# EAGLE schematic STM32EDUv1p0 (EAGLE 5.10)

## Sheet 1 of 3
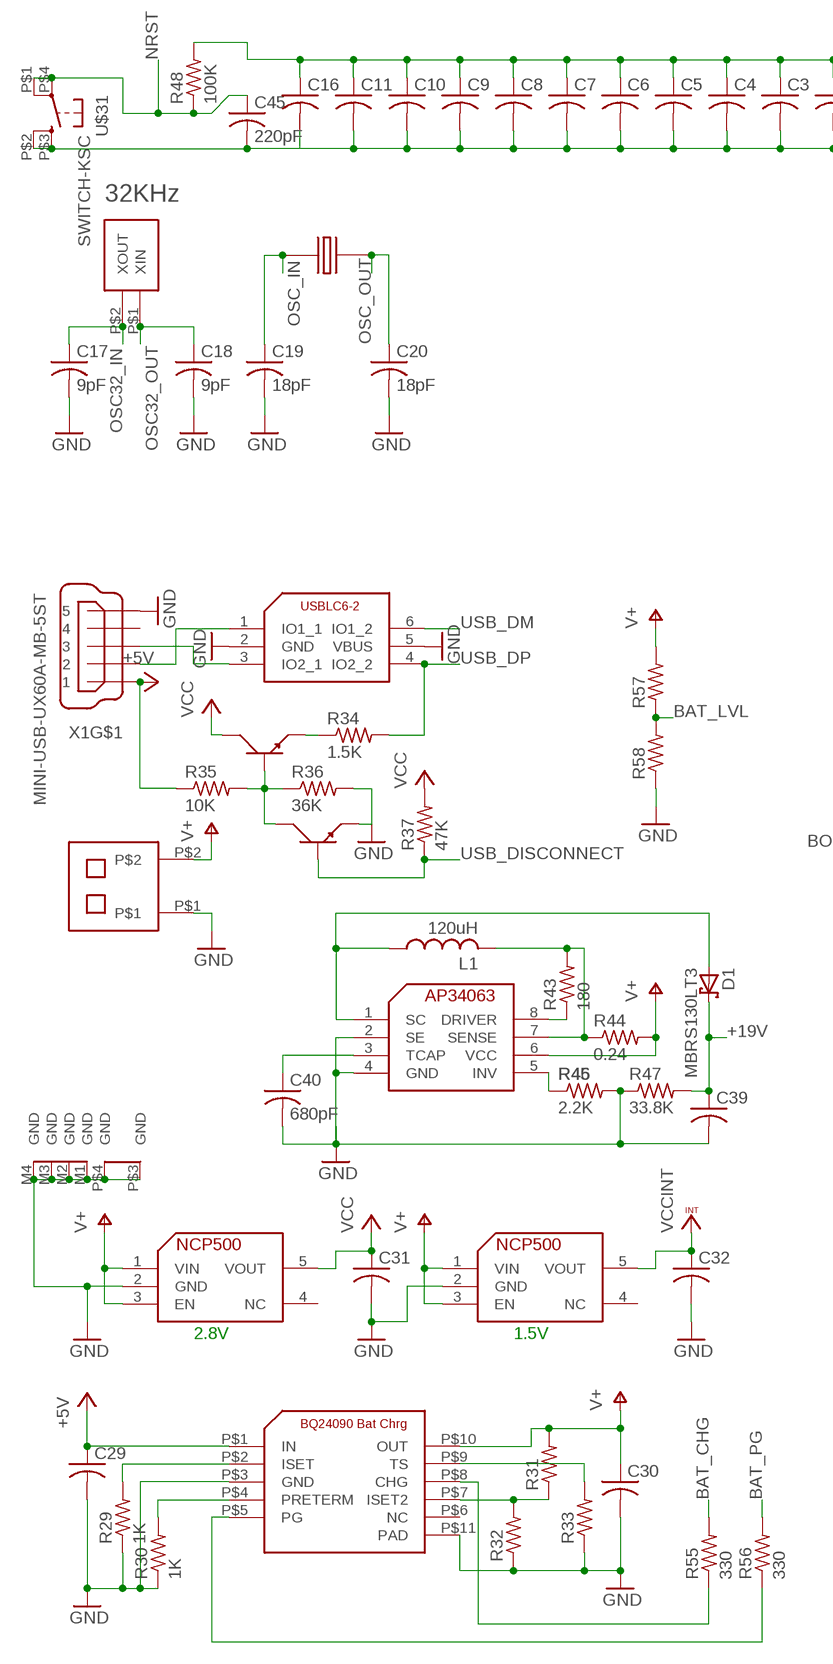
[diagram p0: schematic, sheet 1, part 1 of 2]
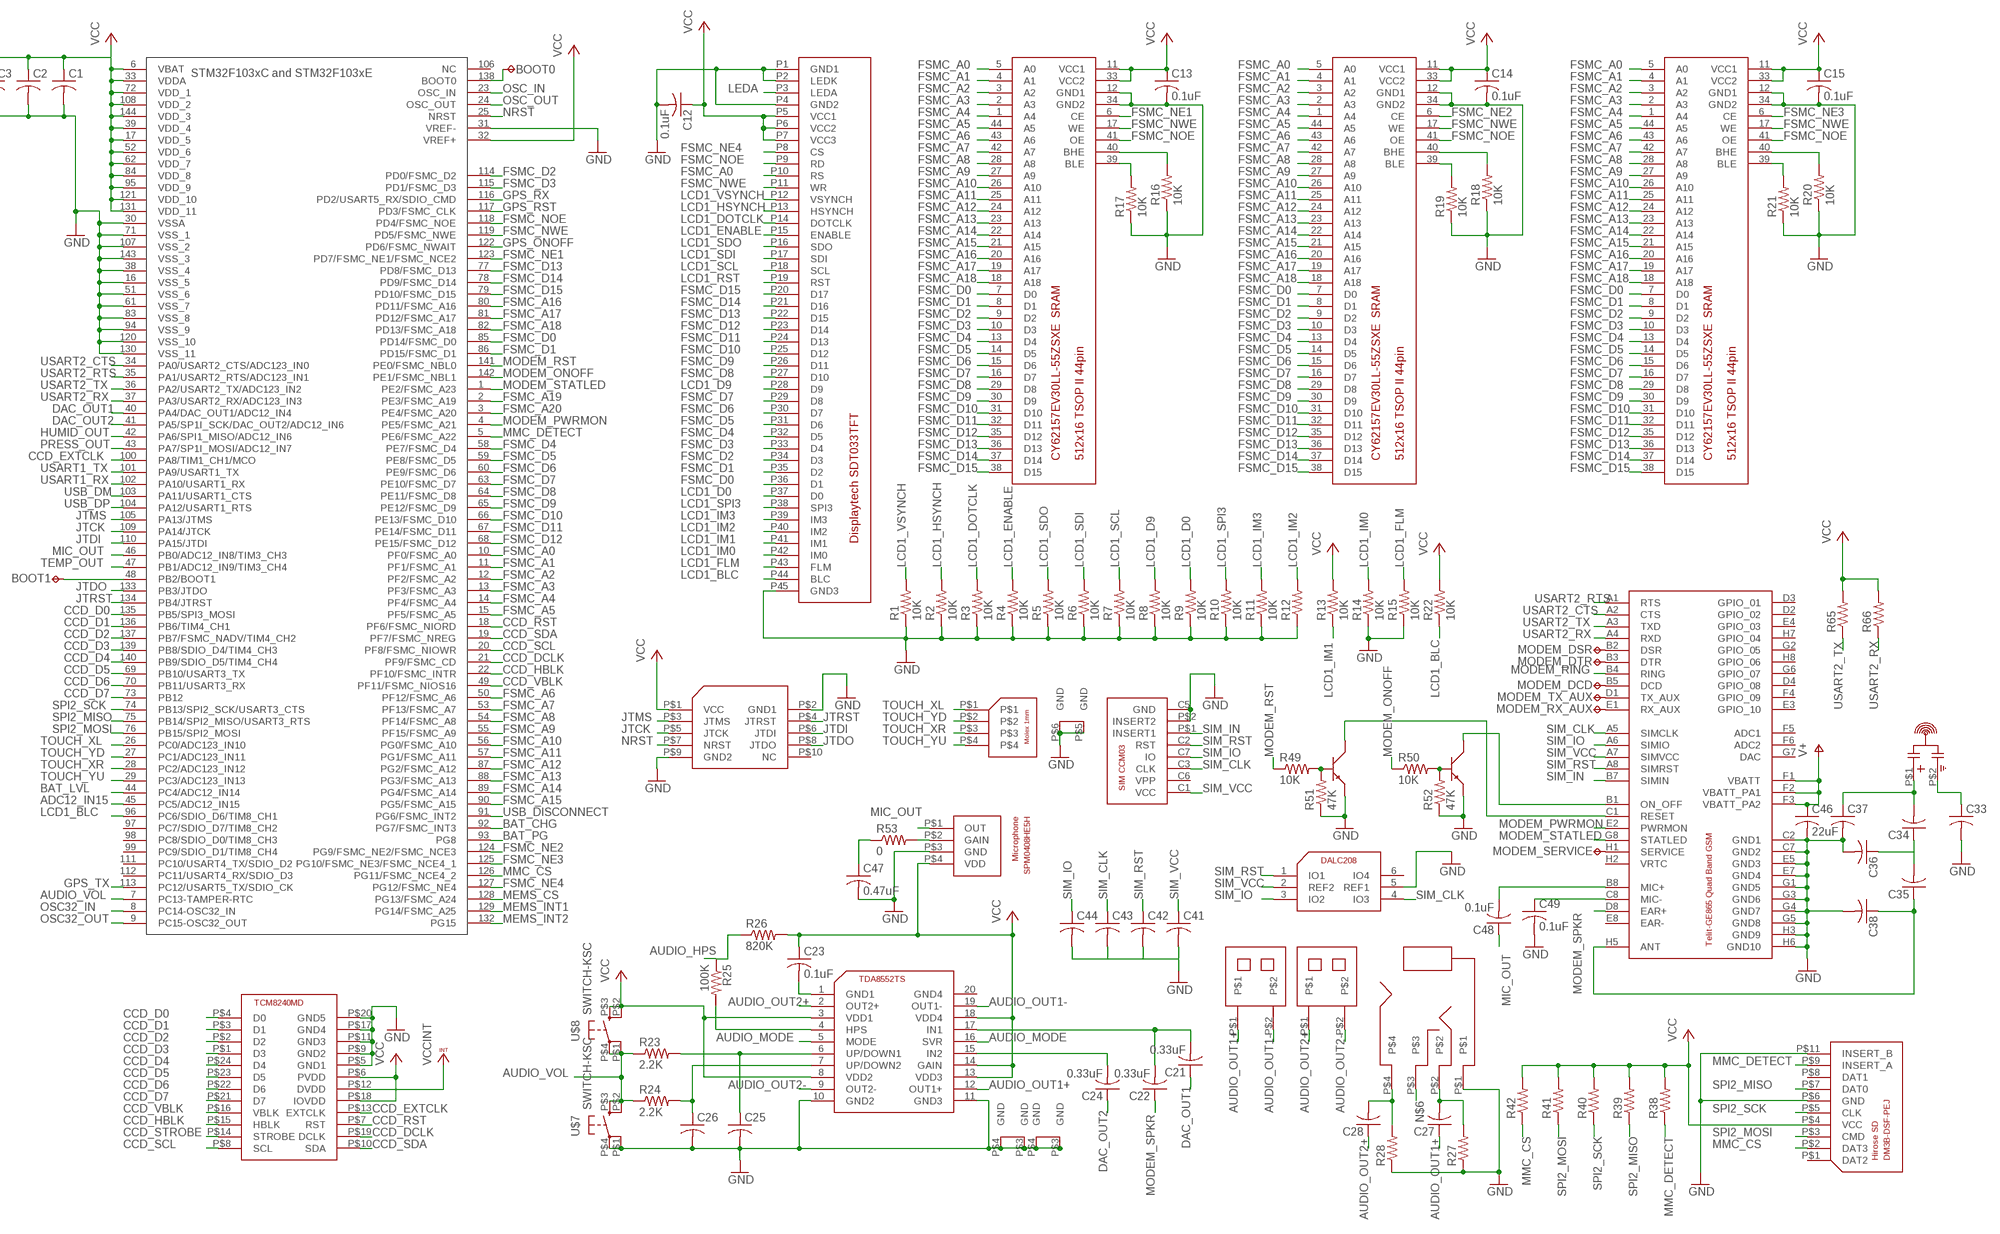
[diagram p1: schematic, sheet 1, part 2 of 2]

### Parts
BOOT0  TPB1,27  [B1,27]
BOOT1  TPB1,27  [B1,27]
C1  C-USC0402  [C0402]
C2  C-USC0402  [C0402]
C3  C-USC0402  [C0402]
C4  C-USC0402  [C0402]
C5  C-USC0402  [C0402]
C6  C-USC0402  [C0402]
C7  C-USC0402  [C0402]
C8  C-USC0402  [C0402]
C9  C-USC0402  [C0402]
C10  C-USC0402  [C0402]
C11  C-USC0402  [C0402]
C12  0.1uF  C-USC0402  [C0402]
C13  0.1uF  C-USC0402  [C0402]
C14  0.1uF  C-USC0402  [C0402]
C15  0.1uF  C-USC0402  [C0402]
C16  C-USC0402  [C0402]
C17  9pF  C-USC0402  [C0402]
C18  9pF  C-USC0402  [C0402]
C19  18pF  C-USC0402  [C0402]
C20  18pF  C-USC0402  [C0402]
C21  0.33uF  C-USC0402  [C0402]
C22  0.33uF  C-USC0402  [C0402]
C23  0.1uF  C-USC0402  [C0402]
C24  0.33uF  C-USC0402  [C0402]
C25  C-USC0402  [C0402]
C26  C-USC0402  [C0402]
C27  C-USC0402  [C0402]
C28  C-USC0402  [C0402]
C29  C-USC1206  [C1206]
C30  C-USC1206  [C1206]
C31  C-USC0402  [C0402]
C32  C-USC0402  [C0402]
C33  C-USC0603  [C0603]
C34  C-USC0603  [C0603]
C35  C-USC0603  [C0603]
C36  C-USC0603  [C0603]
C37  C-USC0603  [C0603]
C38  C-USC0603  [C0603]
C39  C-USC1206  [C1206]
C40  680pF  C-USC0402  [C0402]
C41  C-USC0402  [C0402]
C42  C-USC0402  [C0402]
C43  C-USC0402  [C0402]
C44  C-USC0402  [C0402]
C45  220pF  C-USC0402  [C0402]
C46  22uF  C-USC1206  [C1206]
C47  0.47uF  C-USC0402  [C0402]
C48  0.1uF  C-USC0402  [C0402]
C49  0.1uF  C-USC0402  [C0402]
D1  MBRS130LT3  [SMB]
L1  120uH  L-USL5038P  [L5038P]
MODEM_DCD  TPB1,27  [B1,27]
MODEM_DSR  TPB1,27  [B1,27]
MODEM_DTR  TPB1,27  [B1,27]
MODEM_RX_AUX  TPB1,27  [B1,27]
MODEM_SERVICE  TPB1,27  [B1,27]
MODEM_TX_AUX  TPB1,27  [B1,27]
R1  10K  R-US_R0402  [R0402]
R2  10K  R-US_R0402  [R0402]
R3  10K  R-US_R0402  [R0402]
R4  10K  R-US_R0402  [R0402]
R5  10K  R-US_R0402  [R0402]
R6  10K  R-US_R0402  [R0402]
R7  10K  R-US_R0402  [R0402]
R8  10K  R-US_R0402  [R0402]
R9  10K  R-US_R0402  [R0402]
R10  10K  R-US_R0402  [R0402]
R11  10K  R-US_R0402  [R0402]
R12  R-US_R0402  [R0402]
R13  10K  R-US_R0402  [R0402]
R14  10K  R-US_R0402  [R0402]
R15  10K  R-US_R0402  [R0402]
R16  10K  R-US_R0402  [R0402]
R17  10K  R-US_R0402  [R0402]
R18  10K  R-US_R0402  [R0402]
R19  10K  R-US_R0402  [R0402]
R20  10K  R-US_R0402  [R0402]
R21  10K  R-US_R0402  [R0402]
R22  10K  R-US_R0402  [R0402]
R23  2.2K  R-US_R0402  [R0402]
R24  2.2K  R-US_R0402  [R0402]
R25  100K  R-US_R0402  [R0402]
R26  820K  R-US_R0402  [R0402]
R27  R-US_R0402  [R0402]
R28  R-US_R0402  [R0402]
R29  1K  R-US_R0402  [R0402]
R30  1K  R-US_R0402  [R0402]
R31  R-US_R0402  [R0402]
R32  R-US_R0402  [R0402]
R33  R-US_R0402  [R0402]
R34  1.5K  R-US_R0402  [R0402]
R35  10K  R-US_R0402  [R0402]
R36  36K  R-US_R0402  [R0402]
R37  47K  R-US_R0402  [R0402]
R38  R-US_R0402  [R0402]
R39  R-US_R0402  [R0402]
R40  R-US_R0402  [R0402]
R41  R-US_R0402  [R0402]
R42  R-US_R0402  [R0402]
R43  180  R-US_R0402  [R0402]
R44  0.24  R-US_R0603  [R0603]
R45  R-US_R0402  [R0402]
R46  2.2K  R-US_R0402  [R0402]
R47  33.8K  R-US_R0402  [R0402]
R48  100K  R-US_R0402  [R0402]
R49  10K  R-US_R0402  [R0402]
R50  10K  R-US_R0402  [R0402]
R51  47K  R-US_R0402  [R0402]
R52  47K  R-US_R0402  [R0402]
R53  0  R-US_R0402  [R0402]
R55  330  R-US_R0402  [R0402]
R56  330  R-US_R0402  [R0402]
R57  R-US_R0402  [R0402]
R58  R-US_R0402  [R0402]
R65  R-US_R0402  [R0402]
R66  R-US_R0402  [R0402]
U3  CM415  [CM415]
U5  CRYSTAL-ABM3  [ABM3]
U$1  TCM8240MD  [TCM8240MD]
U$2  STM32F103XE  [PQFP144]
U$3  MOLEX-1.0-FPC-RA-CONN-4POS  [MOLEX-1.0-FPC-RA-CONN-4POS]
U$4  NCP500  [SOT23-5L]
U$5  TDA8552TS  [SSOP20]
U$6  BQ24090  [R-PDSO-G10]
U$7  SWITCH-KSC  [SWITCH_KMS]
U$8  SWITCH-KSC  [SWITCH_KMS]
U$9  MOLEX-1.25-WTB-RA-CONN-2POS  [MOLEX-1.25WTB-RA-CONN]
U$10  STM32-JTAG-10P  [STM32-JTAG-10P]
U$11  DISPLAYTECH-SDT033TFTH  [HIROSE-FFC-FH19SC-45]
U$12  CY62157EV30LL-55ZSXE  [TSOPII-44]
U$13  CY62157EV30LL-55ZSXE  [TSOPII-44]
U$14  CY62157EV30LL-55ZSXE  [TSOPII-44]
U$15  MOLEX-1.25-WTB-RA-CONN-2POS  [MOLEX-1.25WTB-RA-CONN]
U$16  MOLEX-1.25-WTB-RA-CONN-2POS  [MOLEX-1.25WTB-RA-CONN]
U$17  KOBICONN-161-4034-E-TOP  [KOBICONN-161-403X-E-TOP]
U$18  NCP500  [SOT23-5L]
U$19  TELIT-GE865T  [TELIT-GE865]
U$20  CCM03-3009  [CCM03-300X]
U$21  DIODESINC-AP34063  [SO08]
U$22  USBLC6-2  [SOT23-6L]
U$23  PMBT6428  [SOT23]
U$24  PMBT6428  [SOT23]
U$25  HIROSE-SDCARD-DM3B-DSF-PEJ  [HIROSE-SDCARD-DM3B-DSF-PEJ]
U$26  REFLEXUS-A10315  [REFLEXUS-A10315]
U$27  DALC208  [SOT23-6L]
U$28  SPM0408HE5H  [SP0408HE5H-BOT]
U$29  PMBT6428  [SOT23]
U$30  PMBT6428  [SOT23]
U$31  SWITCH-KSC  [SWITCH_KMS]
X1  MINI-USB-UX60A-MB-5ST  [UX60A-MB-5ST]

### Nets
+5V: C29.1 R35.1 U$6.P$1(IN) X1.1
+19V: C39.1 D1.C R47.2
ADC12_IN15: U$2.45(PC5/ADC12_IN15)
AUDIO_HPS: R25.1 R26.1
AUDIO_MODE: U$5.5(MODE) U$5.16(SVR)
AUDIO_OUT1+: C27.1 U$5.12(OUT1+) U$9.P$1
AUDIO_OUT1-: U$5.19(OUT1-) U$9.P$2
AUDIO_OUT2+: C28.1 U$5.2(OUT2+) U$15.P$1
AUDIO_OUT2-: U$5.9(OUT2-) U$15.P$2
AUDIO_VOL: R23.1 R24.1 U$2.7(PC13-TAMPER-RTC) U$7.P$2(P3) U$7.P$3(P1) U$8.P$1(P4) U$8.P$4(P2)
BAT_CHG: R55.2 U$2.92(PG7/FSMC_INT3)
BAT_LVL: R57.1 R58.2 U$2.44(PC4/ADC12_IN14)
BAT_PG: R56.2 U$2.93(PG8)
CCD_D0: U$1.P$4(D0) U$2.135(PB5/SPI3_MOSI)
CCD_D1: U$1.P$3(D1) U$2.136(PB6/TIM4_CH1)
CCD_D2: U$1.P$2(D2) U$2.137(PB7/FSMC_NADV/TIM4_CH2)
CCD_D3: U$1.P$1(D3) U$2.139(PB8/SDIO_D4/TIM4_CH3)
CCD_D4: U$1.P$24(D4) U$2.140(PB9/SDIO_D5/TIM4_CH4)
CCD_D5: U$1.P$23(D5) U$2.69(PB10/USART3_TX)
CCD_D6: U$1.P$22(D6) U$2.70(PB11/USART3_RX)
CCD_D7: U$1.P$21(D7) U$2.73(PB12)
CCD_DCLK: U$1.P$19(DCLK) U$2.21(PF9/FSMC_CD)
CCD_EXTCLK: U$1.P$13(EXTCLK) U$2.100(PA8/TIM1_CH1/MCO)
CCD_HBLK: U$1.P$15(HBLK) U$2.22(PF10/FSMC_INTR)
CCD_RST: U$1.P$7(RST) U$2.18(PF6/FSMC_NIORD)
CCD_SCL: U$1.P$8(SCL) U$2.20(PF8/FSMC_NIOWR)
CCD_SDA: U$1.P$10(SDA) U$2.19(PF7/FSMC_NREG)
CCD_STROBE: U$1.P$14(STROBE)
CCD_VBLK: U$1.P$16(VBLK) U$2.49(PF11/FSMC_NIOS16)
DAC_OUT1: C21.1 U$2.40(PA4/DAC_OUT1/ADC12_IN4)
DAC_OUT2: C24.1 U$2.41(PA5/SP1I_SCK/DAC_OUT2/ADC12_IN6)
FSMC_A0: U$2.10(PF0/FSMC_A0) U$11.P10(RS) U$12.5(A0) U$13.5(A0) U$14.5(A0)
FSMC_A1: U$2.11(PF1/FSMC_A1) U$12.4(A1) U$13.4(A1) U$14.4(A1)
FSMC_A2: U$2.12(PF2/FSMC_A2) U$12.3(A2) U$13.3(A2) U$14.3(A2)
FSMC_A3: U$2.13(PF3/FSMC_A3) U$12.2(A3) U$13.2(A3) U$14.2(A3)
FSMC_A4: U$2.14(PF4/FSMC_A4) U$12.1(A4) U$13.1(A4) U$14.1(A4)
FSMC_A5: U$2.15(PF5/FSMC_A5) U$12.44(A5) U$13.44(A5) U$14.44(A5)
FSMC_A6: U$2.50(PF12/FSMC_A6) U$12.43(A6) U$13.43(A6) U$14.43(A6)
FSMC_A7: U$2.53(PF13/FSMC_A7) U$12.42(A7) U$13.42(A7) U$14.42(A7)
FSMC_A8: U$2.54(PF14/FSMC_A8) U$12.28(A8) U$13.28(A8) U$14.28(A8)
FSMC_A9: U$2.55(PF15/FSMC_A9) U$12.27(A9) U$13.27(A9) U$14.27(A9)
FSMC_A10: U$2.56(PG0/FSMC_A10) U$12.26(A10) U$13.26(A10) U$14.26(A10)
FSMC_A11: U$2.57(PG1/FSMC_A11) U$12.25(A11) U$13.25(A11) U$14.25(A11)
FSMC_A12: U$2.87(PG2/FSMC_A12) U$12.24(A12) U$13.24(A12) U$14.24(A12)
FSMC_A13: U$2.88(PG3/FSMC_A13) U$12.23(A13) U$13.23(A13) U$14.23(A13)
FSMC_A14: U$2.89(PG4/FSMC_A14) U$12.22(A14) U$13.22(A14) U$14.22(A14)
FSMC_A15: U$2.90(PG5/FSMC_A15) U$12.21(A15) U$13.21(A15) U$14.21(A15)
FSMC_A16: U$2.80(PD11/FSMC_A16) U$12.20(A16) U$13.20(A16) U$14.20(A16)
FSMC_A17: U$2.81(PD12/FSMC_A17) U$12.19(A17) U$13.19(A17) U$14.19(A17)
FSMC_A18: U$2.82(PD13/FSMC_A18) U$12.18(A18) U$13.18(A18) U$14.18(A18)
FSMC_A19: U$2.2(PE3/FSMC_A19)
FSMC_A20: U$2.3(PE4/FSMC_A20)
FSMC_D0: U$2.85(PD14/FSMC_D0) U$11.P36(D1) U$12.7(D0) U$13.7(D0) U$14.7(D0)
FSMC_D1: U$2.86(PD15/FSMC_D1) U$11.P35(D2) U$12.8(D1) U$13.8(D1) U$14.8(D1)
FSMC_D2: U$2.114(PD0/FSMC_D2) U$11.P34(D3) U$12.9(D2) U$13.9(D2) U$14.9(D2)
FSMC_D3: U$2.115(PD1/FSMC_D3) U$11.P33(D4) U$12.10(D3) U$13.10(D3) U$14.10(D3)
FSMC_D4: U$2.58(PE7/FSMC_D4) U$11.P32(D5) U$12.13(D4) U$13.13(D4) U$14.13(D4)
FSMC_D5: U$2.59(PE8/FSMC_D5) U$11.P31(D6) U$12.14(D5) U$13.14(D5) U$14.14(D5)
FSMC_D6: U$2.60(PE9/FSMC_D6) U$11.P30(D7) U$12.15(D6) U$13.15(D6) U$14.15(D6)
FSMC_D7: U$2.63(PE10/FSMC_D7) U$11.P29(D8) U$12.16(D7) U$13.16(D7) U$14.16(D7)
FSMC_D8: U$2.64(PE11/FSMC_D8) U$11.P27(D10) U$12.29(D8) U$13.29(D8) U$14.29(D8)
FSMC_D9: U$2.65(PE12/FSMC_D9) U$11.P26(D11) U$12.30(D9) U$13.30(D9) U$14.30(D9)
FSMC_D10: U$2.66(PE13/FSMC_D10) U$11.P25(D12) U$12.31(D10) U$13.31(D10) U$14.31(D10)
FSMC_D11: U$2.67(PE14/FSMC_D11) U$11.P24(D13) U$12.32(D11) U$13.32(D11) U$14.32(D11)
FSMC_D12: U$2.68(PE15/FSMC_D12) U$11.P23(D14) U$12.35(D12) U$13.35(D12) U$14.35(D12)
FSMC_D13: U$2.77(PD8/FSMC_D13) U$11.P22(D15) U$12.36(D13) U$13.36(D13) U$14.36(D13)
FSMC_D14: U$2.78(PD9/FSMC_D14) U$11.P21(D16) U$12.37(D14) U$13.37(D14) U$14.37(D14)
FSMC_D15: U$2.79(PD10/FSMC_D15) U$11.P20(D17) U$12.38(D15) U$13.38(D15) U$14.38(D15)
FSMC_NE1: U$2.123(PD7/FSMC_NE1/FSMC_NCE2) U$12.6(CE)
FSMC_NE2: U$2.124(PG9/FSMC_NE2/FSMC_NCE3) U$13.6(CE)
FSMC_NE3: U$2.125(PG10/FSMC_NE3/FSMC_NCE4_1) U$14.6(CE)
FSMC_NE4: U$2.127(PG12/FSMC_NE4) U$11.P8(CS)
FSMC_NOE: U$2.118(PD4/FSMC_NOE) U$11.P9(RD) U$12.41(OE) U$13.41(OE) U$14.41(OE)
FSMC_NWE: U$2.119(PD5/FSMC_NWE) U$11.P11(WR) U$12.17(WE) U$13.17(WE) U$14.17(WE)
GND: C1.2 C2.2 C3.2 C4.2 C5.2 C6.2 C7.2 C8.2 C9.2 C10.2 C11.2 C12.2 C13.2 C14.2 C15.2 C16.2 C17.2 C18.2 C19.2 C20.2 C25.2 C26.2 C29.2 C30.2 C31.2 C32.2 C33.2 C36.2 C37.2 C38.2 C39.2 C40.2 C41.2 C42.2 C43.2 C44.2 C45.2 C46.2 C47.2 C49.2 R1.1 R2.1 R3.1 R4.1 R5.1 R6.1 R7.1 R8.1 R9.1 R10.1 R11.1 R12.1 R14.1 R15.1 R16.1 R17.1 R18.1 R19.1 R20.1 R21.1 R27.1 R28.1 R29.1 R30.1 R32.1 R33.1 R36.2 R45.2 R46.2 R47.1 R51.1 R52.1 R58.1 U$1.P$5(GND1) U$1.P$9(GND2) U$1.P$11(GND3) U$1.P$17(GND4) U$1.P$20(GND5) U$2.16(VSS_5) U$2.30(VSSA) U$2.31(VREF-) U$2.38(VSS_4) U$2.51(VSS_6) U$2.61(VSS_7) U$2.71(VSS_1) U$2.83(VSS_8) U$2.94(VSS_9) U$2.107(VSS_2) U$2.120(VSS_10) U$2.130(VSS_11) U$2.143(VSS_3) U$3.P$5(GND) U$3.P$6(GND) U$4.2(GND) U$5.10(GND2) U$5.11(GND3) U$6.P$3(GND) U$6.P$11(PAD) U$7.P$1(P4) U$7.P$4(P2) U$9.P$3(GND) U$9.P$4(GND) U$10.P$2(GND1) U$10.P$9(GND2) U$11.P1(GND1) U$11.P2(LEDK) U$11.P4(GND2) U$11.P45(GND3) U$12.12(GND1) U$12.34(GND2) U$13.12(GND1) U$13.34(GND2) U$14.12(GND1) U$14.34(GND2) U$15.P$3(GND) U$15.P$4(GND) U$16.P$1 U$16.P$3(GND) U$16.P$4(GND) U$17.P$1 U$18.2(GND) U$19.C2(GND1) U$19.C7(GND2) U$19.E5(GND3) U$19.E7(GND4) U$19.G1(GND5) U$19.G3(GND6) U$19.G4(GND7) U$19.G5(GND8) U$19.H3(GND9) U$19.H6(GND10) U$20.C5(GND) U$20.P$2(INSERT2) U$21.2(SE) U$21.4(GND) U$22.2(GND) U$22.5(VBUS) U$24.2 U$25.P$6(GND) U$25.P$11(INSERT_B) U$27.5(REF1) U$28.P$3(GND) U$29.2 U$30.2 U$31.P$2(P3) U$31.P$3(P1) X1.5 X1.M1(GND) X1.M2(GND) X1.M3(GND) X1.M4(GND) ; also sheet 2,3
GPS_ONOFF: U$2.122(PD6/FSMC_NWAIT) ; also sheet 3
GPS_RST: U$2.117(PD3/FSMC_CLK) ; also sheet 3
GPS_RX: U$2.116(PD2/USART5_RX/SDIO_CMD) ; also sheet 3
GPS_TX: U$2.113(PC12/USART5_TX/SDIO_CK) ; also sheet 3
HUMID_OUT: U$2.42(PA6/SPI1_MISO/ADC12_IN6) ; also sheet 2
JTCK: U$2.109(PA14/JTCK) U$10.P$5(JTCK)
JTDI: U$2.110(PA15/JTDI) U$10.P$6(JTDI)
JTDO: U$2.133(PB3/JTDO) U$10.P$8(JTDO)
JTMS: U$2.105(PA13/JTMS) U$10.P$3(JTMS)
JTRST: U$2.134(PB4/JTRST) U$10.P$4(JTRST)
LCD1_BLC: R22.1 U$2.96(PC6/SDIO_D6/TIM8_CH1) U$11.P44(BLC)
LCD1_D0: R9.2 U$11.P37(D0)
LCD1_D9: R8.2 U$11.P28(D9)
LCD1_DOTCLK: R3.2 U$11.P14(DOTCLK)
LCD1_ENABLE: R4.2 U$11.P15(ENABLE)
LCD1_FLM: R15.2 U$11.P43(FLM)
LCD1_HSYNCH: R2.2 U$11.P13(HSYNCH)
LCD1_IM0: R14.2 U$11.P42(IM0)
LCD1_IM1: R13.1 U$11.P41(IM1)
LCD1_IM2: R12.2 U$11.P40(IM2)
LCD1_IM3: R11.2 U$11.P39(IM3)
LCD1_RST: U$11.P19(RST)
LCD1_SCL: R7.2 U$11.P18(SCL)
LCD1_SDI: R6.2 U$11.P17(SDI)
LCD1_SDO: R5.2 U$11.P16(SDO)
LCD1_SPI3: R10.2 U$11.P38(SPI3)
LCD1_VSYNCH: R1.2 U$11.P12(VSYNCH)
LEDA: U$11.P3(LEDA)
MEMS_CS: U$2.128(PG13/FSMC_A24) ; also sheet 2
MEMS_INT1: U$2.129(PG14/FSMC_A25) ; also sheet 2
MEMS_INT2: U$2.132(PG15) ; also sheet 2
MIC_OUT: C48.1 U$2.46(PB0/ADC12_IN8/TIM3_CH3) U$28.P$1(OUT)
MMC_CS: R42.1 U$2.126(PG11/FSMC_NCE4_2) U$25.P$2(DAT3)
MMC_DETECT: R38.1 U$2.5(PE6/FSMC_A22) U$25.P$9(INSERT_A)
MODEM_ONOFF: R50.1 U$2.142(PE1/FSMC_NBL1)
MODEM_PWRMON: U$2.4(PE5/FSMC_A21) U$19.E2(PWRMON)
MODEM_RING: U$19.B4(RING)
MODEM_RST: R49.1 U$2.141(PE0/FSMC_NBL0)
MODEM_SPKR: C22.1 U$19.D8(EAR+)
MODEM_STATLED: U$2.1(PE2/FSMC_A23) U$19.G8(STATLED)
N$1: BOOT1.TP U$2.48(PB2/BOOT1)
N$2: BOOT0.TP U$2.138(BOOT0)
N$3: R16.2 U$12.40(BHE)
N$4: R35.2 R36.1 U$23.1 U$24.3
N$5: C23.2 U$5.1(GND1)
N$6: U$17.P$3
N$7: C28.2 R28.2 U$17.P$4
N$8: C27.2 R27.2 U$17.P$2
N$9: C21.2 C22.2 U$5.17(IN1)
N$10: C24.2 U$5.15(IN2)
N$11: C25.1 R23.2 U$5.6(UP/DOWN1)
N$12: C26.1 R24.2 U$5.7(UP/DOWN2)
N$13: R25.2 U$5.4(HPS)
N$14: R30.2 U$6.P$4(PRETERM)
N$15: R17.2 U$12.39(BLE)
N$16: R18.2 U$13.40(BHE)
N$17: R29.2 U$6.P$2(ISET)
N$18: R19.2 U$13.39(BLE)
N$19: U$22.1(IO1_1) X1.2
N$20: R33.2 U$6.P$9(TS)
N$21: R31.1 R32.2 U$6.P$7(ISET2)
N$22: U$22.3(IO2_1) X1.3
N$23: MODEM_DSR.TP U$19.B2(DSR)
N$24: MODEM_DTR.TP U$19.B3(DTR)
N$25: R34.1 U$23.2
N$26: MODEM_DCD.TP U$19.B5(DCD)
N$27: MODEM_TX_AUX.TP U$19.D1(TX_AUX)
N$28: MODEM_RX_AUX.TP U$19.E1(RX_AUX)
N$29: C34.2 C37.1 U$26.P$1(ANTP)
N$30: C34.1 C35.2 C36.1
N$31: C35.1 C38.1 U$19.H5(ANT)
N$32: C33.1 U$26.P$2(ANTN)
N$33: R43.1 U$21.8(DRIVER)
N$34: C40.1 U$21.3(TCAP)
N$35: L1.2 R43.2 R44.1 U$21.7(SENSE)
N$36: D1.A L1.1 U$21.1(SC)
N$37: R45.1 R46.1 U$21.5(INV)
N$39: U$19.C1(RESET) U$30.3
N$40: MODEM_SERVICE.TP U$19.H1(SERVICE)
N$41: U$19.B1(ON_OFF) U$29.3
N$42: R49.2 R51.2 U$30.1
N$43: R50.2 R52.2 U$29.1
N$47: R53.2 U$28.P$2(GAIN)
N$48: C47.1 R53.1
N$49: C48.2 U$19.B8(MIC+)
N$50: C49.1 U$19.C8(MIC-)
N$51: R55.1 U$6.P$8(CHG)
N$54: R56.1 U$6.P$5(PG)
N$60: R21.2 U$14.39(BLE)
N$61: R20.2 U$14.40(BHE)
NRST: C45.1 R48.1 U$2.25(NRST) U$10.P$7(NRST) U$31.P$1(P4) U$31.P$4(P2)
OSC32_IN: C17.1 U3.P$2(XOUT) U$2.8(PC14-OSC32_IN)
OSC32_OUT: C18.1 U3.P$1(XIN) U$2.9(PC15-OSC32_OUT)
OSC_IN: C19.1 U5.P$1 U$2.23(OSC_IN)
OSC_OUT: C20.1 U5.P$2 U$2.24(OSC_OUT)
PRESS_OUT: U$2.43(PA7/SP1I_MOSI/ADC12_IN7) ; also sheet 2
SIM_CLK: C43.1 U$19.A5(SIMCLK) U$20.C3(CLK) U$27.4(IO3)
SIM_IN: U$19.B7(SIMIN) U$20.P$1(INSERT1)
SIM_IO: C44.1 U$19.A6(SIMIO) U$20.C7(IO) U$27.3(IO2)
SIM_RST: C42.1 U$19.A8(SIMRST) U$20.C2(RST) U$27.1(IO1)
SIM_VCC: C41.1 U$19.A7(SIMVCC) U$20.C1(VCC) U$27.2(REF2)
SPI2_MISO: R39.1 U$2.75(PB14/SPI2_MISO/USART3_RTS) U$25.P$7(DAT0) ; also sheet 2
SPI2_MOSI: R41.1 U$2.76(PB15/SPI2_MOSI) U$25.P$3(CMD) ; also sheet 2
SPI2_SCK: R40.1 U$2.74(PB13/SPI2_SCK/USART3_CTS) U$25.P$5(CLK) ; also sheet 2
TEMP_OUT: U$2.47(PB1/ADC12_IN9/TIM3_CH4) ; also sheet 2
TOUCH_XL: U$2.26(PC0/ADC123_IN10) U$3.P$1
TOUCH_XR: U$2.28(PC2/ADC123_IN12) U$3.P$3
TOUCH_YD: U$2.27(PC1/ADC123_IN11) U$3.P$2
TOUCH_YU: U$2.29(PC3/ADC123_IN13) U$3.P$4
USART1_RX: U$2.102(PA10/USART1_RX)
USART1_TX: U$2.101(PA9/USART1_TX)
USART2_CTS: U$2.34(PA0/USART2_CTS/ADC123_IN0) U$19.A2(CTS)
USART2_RTS: U$2.35(PA1/USART2_RTS/ADC123_IN1) U$19.A1(RTS)
USART2_RX: R66.1 U$2.37(PA3/USART2_RX/ADC123_IN3) U$19.A4(RXD)
USART2_TX: R65.1 U$2.36(PA2/USART2_TX/ADC123_IN2) U$19.A3(TXD)
USB_DISCONNECT: R37.1 U$2.91(PG6/FSMC_INT2) U$24.1
USB_DM: U$2.103(PA11/USART1_CTS) U$22.6(IO1_2)
USB_DP: R34.2 U$2.104(PA12/USART1_RTS) U$22.4(IO2_2)
V+: C30.1 C46.1 R31.2 R44.2 R57.2 U$4.1(VIN) U$4.3(EN) U$6.P$10(OUT) U$16.P$2 U$18.1(VIN) U$18.3(EN) U$19.F1(VBATT) U$19.F2(VBATT_PA1) U$19.F3(VBATT_PA2) U$21.6(VCC) ; also sheet 3
VCC: C1.1 C2.1 C3.1 C4.1 C5.1 C6.1 C7.1 C8.1 C9.1 C10.1 C11.1 C12.1 C13.1 C14.1 C15.1 C16.1 C23.1 C31.1 R13.2 R22.2 R26.2 R37.2 R38.2 R39.2 R40.2 R41.2 R42.2 R48.2 R65.2 R66.2 U$1.P$6(PVDD) U$1.P$18(IOVDD) U$2.6(VBAT) U$2.17(VDD_5) U$2.32(VREF+) U$2.33(VDDA) U$2.39(VDD_4) U$2.52(VDD_6) U$2.62(VDD_7) U$2.72(VDD_1) U$2.84(VDD_8) U$2.95(VDD_9) U$2.108(VDD_2) U$2.121(VDD_10) U$2.131(VDD_11) U$2.144(VDD_3) U$4.5(VOUT) U$5.3(VDD1) U$5.8(VDD2) U$5.13(VDD3) U$5.14(GAIN) U$5.18(VDD4) U$8.P$2(P3) U$8.P$3(P1) U$10.P$1(VCC) U$11.P5(VCC1) U$11.P6(VCC2) U$11.P7(VCC3) U$12.11(VCC1) U$12.33(VCC2) U$13.11(VCC1) U$13.33(VCC2) U$14.11(VCC1) U$14.33(VCC2) U$23.3 U$25.P$4(VCC) U$28.P$4(VDD) ; also sheet 2,3
VCCINT: C32.1 U$1.P$12(DVDD) U$18.5(VOUT)
Unconnected: U$2.97(PC7/SDIO_D7/TIM8_CH2) U$2.98(PC8/SDIO_D0/TIM8_CH3) U$2.99(PC9/SDIO_D1/TIM8_CH4) U$2.106(NC) U$2.111(PC10/USART4_TX/SDIO_D2) U$2.112(PC11/USART4_RX/SDIO_D3) U$4.4(NC) U$5.20(GND4) U$6.P$6(NC) U$10.P$10(NC) U$18.4(NC) U$19.D2(GPIO_02) U$19.D3(GPIO_01) U$19.D4(GPIO_08) U$19.E3(GPIO_10) U$19.E4(GPIO_03) U$19.E8(EAR-) U$19.F4(GPIO_09) U$19.F5(ADC1) U$19.F6(ADC2) U$19.G2(GPIO_05) U$19.G6(GPIO_07) U$19.G7(DAC) U$19.H2(VRTC) U$19.H7(GPIO_04) U$19.H8(GPIO_06) U$20.C6(VPP) U$25.P$1(DAT2) U$25.P$8(DAT1) U$27.6(IO4) X1.4

### Notes on the sheet
- 2.8V | 1.5V

## Sheet 2 of 3
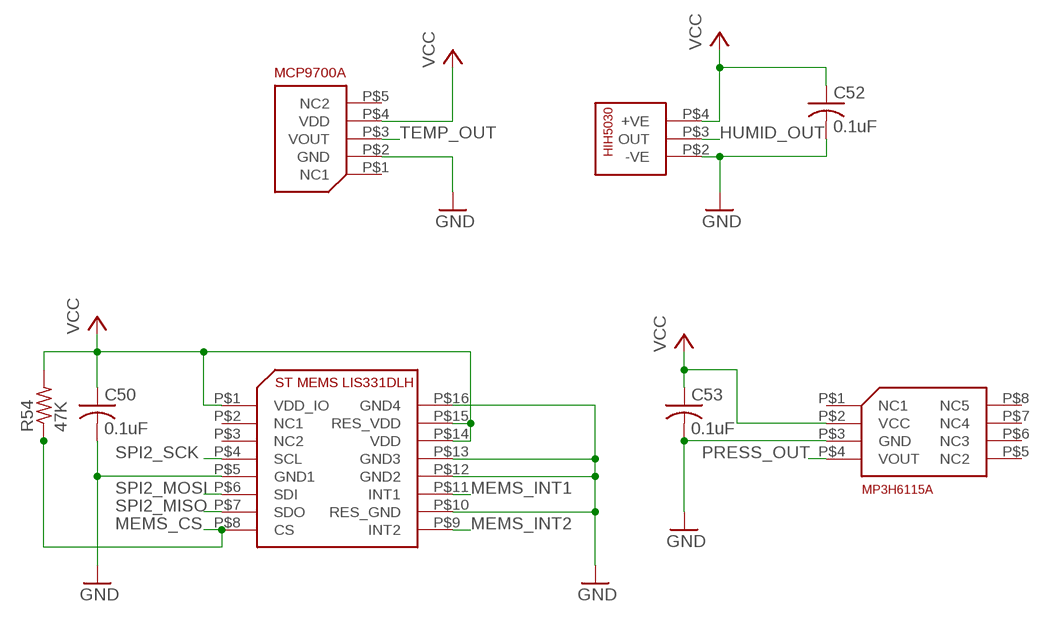
[diagram p2: schematic, sheet 2]

### Parts
C50  0.1uF  C-USC0402  [C0402]
C52  0.1uF  C-USC0402  [C0402]
C53  0.1uF  C-USC0402  [C0402]
R54  47K  R-US_R0402  [R0402]
U$32  LIS331DLH  [LIS331DLH]
U$33  MCP9700A  [SC-70-5]
U$34  HIH-5030  [HIH-5030]
U$35  MP3H6115A  [SSOP8]

### Nets
GND: C50.2 C52.2 C53.2 U$32.P$5(GND1) U$32.P$10(RES_GND) U$32.P$12(GND2) U$32.P$13(GND3) U$32.P$16(GND4) U$33.P$2(GND) U$34.P$2(-VE) U$35.P$3(GND) ; also sheet 1,3
HUMID_OUT: U$34.P$3(OUT) ; also sheet 1
MEMS_CS: R54.1 U$32.P$8(CS) ; also sheet 1
MEMS_INT1: U$32.P$11(INT1) ; also sheet 1
MEMS_INT2: U$32.P$9(INT2) ; also sheet 1
PRESS_OUT: U$35.P$4(VOUT) ; also sheet 1
SPI2_MISO: U$32.P$7(SDO) ; also sheet 1
SPI2_MOSI: U$32.P$6(SDI) ; also sheet 1
SPI2_SCK: U$32.P$4(SCL) ; also sheet 1
TEMP_OUT: U$33.P$3(VOUT) ; also sheet 1
VCC: C50.1 C52.1 C53.1 R54.2 U$32.P$1(VDD_IO) U$32.P$14(VDD) U$32.P$15(RES_VDD) U$33.P$4(VDD) U$34.P$4(+VE) U$35.P$2(VCC) ; also sheet 1,3
Unconnected: U$32.P$2(NC1) U$32.P$3(NC2) U$33.P$1(NC1) U$33.P$5(NC2) U$35.P$1(NC1) U$35.P$5(NC2) U$35.P$6(NC3) U$35.P$7(NC4) U$35.P$8(NC5)

## Sheet 3 of 3
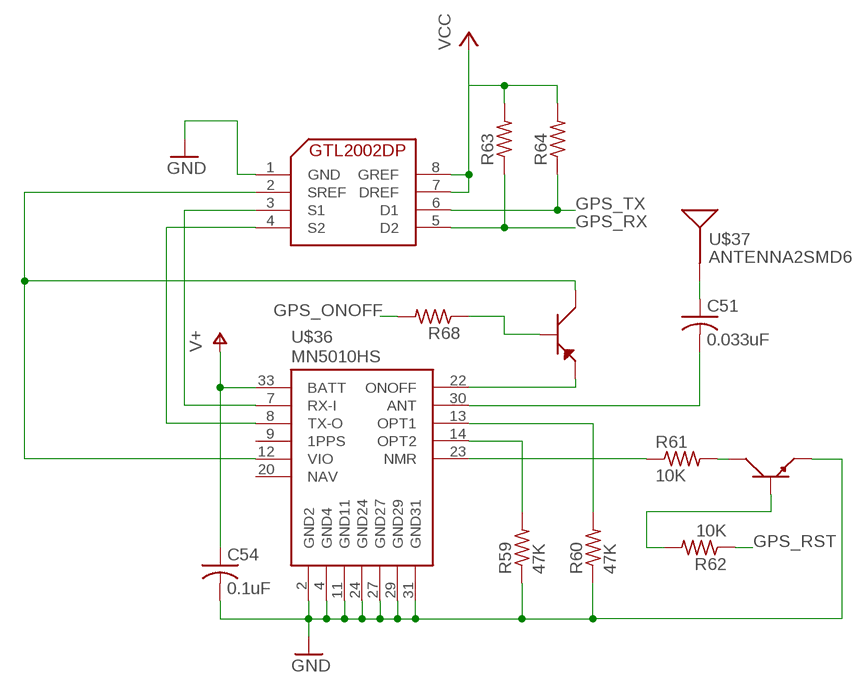
[diagram p3: schematic, sheet 3]

### Parts
C51  0.033uF  C-USC0603  [C0603]
C54  0.1uF  C-USC0402  [C0402]
R59  47K  R-US_R0402  [R0402]
R60  47K  R-US_R0402  [R0402]
R61  10K  R-US_R0402  [R0402]
R62  10K  R-US_R0402  [R0402]
R63  R-US_R0402  [R0402]
R64  R-US_R0402  [R0402]
R68  R-US_R0402  [R0402]
U$36  MN5010HS  [GR-10]
U$37  ANTENNA2SMD6  [ANTENNA-CHIP6]
U$38  PMBT6428  [SOT23]
U$39  NXP-GTL2002  [TSSOP8]
U$40  BIPLOAR-MMBTA92  [SOT23]

### Nets
GND: C54.2 R59.1 R60.1 U$36.2(GND2) U$36.4(GND4) U$36.11(GND11) U$36.24(GND24) U$36.27(GND27) U$36.29(GND29) U$36.31(GND31) U$38.2 U$39.1(GND) ; also sheet 1,2
GPS_ONOFF: R68.2 ; also sheet 1
GPS_RST: R62.1 ; also sheet 1
GPS_RX: R63.1 U$39.5(D2) ; also sheet 1
GPS_TX: R64.1 U$39.6(D1) ; also sheet 1
N$52: C51.2 U$36.30(ANT)
N$53: C51.1 U$37.1(SIGNAL)
N$55: R60.2 U$36.13(OPT1)
N$56: R59.2 U$36.14(OPT2)
N$57: R61.2 U$38.3
N$58: U$36.7(RX-I) U$39.3(S1)
N$59: U$36.8(TX-O) U$39.4(S2)
N$62: R61.1 U$36.23(NMR)
N$63: R62.2 U$38.1
N$64: U$36.12(VIO) U$39.2(SREF) U$40.3
N$66: U$36.22(ONOFF) U$40.2
N$67: R68.1 U$40.1
V+: C54.1 U$36.33(BATT) ; also sheet 1
VCC: R63.2 R64.2 U$39.7(DREF) U$39.8(GREF) ; also sheet 1,2
Unconnected: U$36.9(1PPS) U$36.20(NAV)

## Power pins joined to a net without a drawn wire
GND: U$25.P$12(GND) U$25.P$13(GND) U$25.P$14(GND)

## Library data of the parts
BOOT0 BOOT1 MODEM_DCD MODEM_DSR MODEM_DTR MODEM_RX_AUX MODEM_SERVICE MODEM_TX_AUX = testpad:TP: Test pad
C1-C54 = rcl:C-US: CAPACITOR, American symbol
D1 = diode:MBRS130LT3: Schottky Power Rectifier Source: http://www.onsemi.com/pub/Collateral/MBRS130LT3-D.PDF
L1 = rcl:L-US: INDUCTOR, American symbol
R1-R66 R68 = rcl:R-US_: RESISTOR, American symbol
U3 = dublib:CM415
U5 = dublib:CRYSTAL-ABM3
U$1 = dublib:TCM8240MD
U$2 = dublib:STM32F103XE
U$3 = dublib:MOLEX-1.0-FPC-RA-CONN-4POS
U$4 U$18 = dublib:NCP500
U$5 = dublib:TDA8552TS
U$6 = dublib:BQ24090
U$7 U$8 U$31 = dublib:SWITCH-KSC
U$9 U$15 U$16 = dublib:MOLEX-1.25-WTB-RA-CONN-2POS
U$10 = dublib:STM32-JTAG-10P
U$11 = dublib:DISPLAYTECH-SDT033TFT
U$12-U$14 = dublib:CY62157EV30LL-55ZSXE
U$17 = dublib:KOBICONN-161-4034-E-TOP
U$19 = dublib:TELIT-GE865
U$20 = dublib:CCM03-3009
U$21 = dublib:DIODESINC-AP34063
U$22 = dublib:USBLC6-2
U$23 U$24 U$29 U$30 U$38 = dublib:PMBT6428
U$25 = dublib:HIROSE-SDCARD-DM3B-DSF-PEJ
U$26 = dublib:REFLEXUS-A10315
U$27 = dublib:DALC208
U$28 = dublib:SPM0408HE5H
U$32 = dublib:LIS331DLH
U$33 = dublib:MCP9700A
U$34 = dublib:HIH-5030
U$35 = dublib:MP3H6115A
U$36 = SparkFun:MN5010HS: MN5010HS GPS Receiver Module. Packagse GR-10 and MN5010HS are NOT tested with this device.
U$37 = SparkFun:ANTENNA2: Antenna Single endded antenna. Common with smaller chip antennas. CHIP4 package is the GPS Chip Antenna SKU: GPS-08418. CHIP5 package is 2.4GHz chip antenna SKU: WRL-00144.
U$39 = dublib:NXP-GTL2002
U$40 = dublib:BIPLOAR-MMBTA92
X1 = dublib:MINI-USB-: MINI USB Connector Source: http://www.hirose.co.jp/cataloge_hp/e24000019.pdf